# EAGLE schematic brain_v01 (EAGLE 9.5.2)
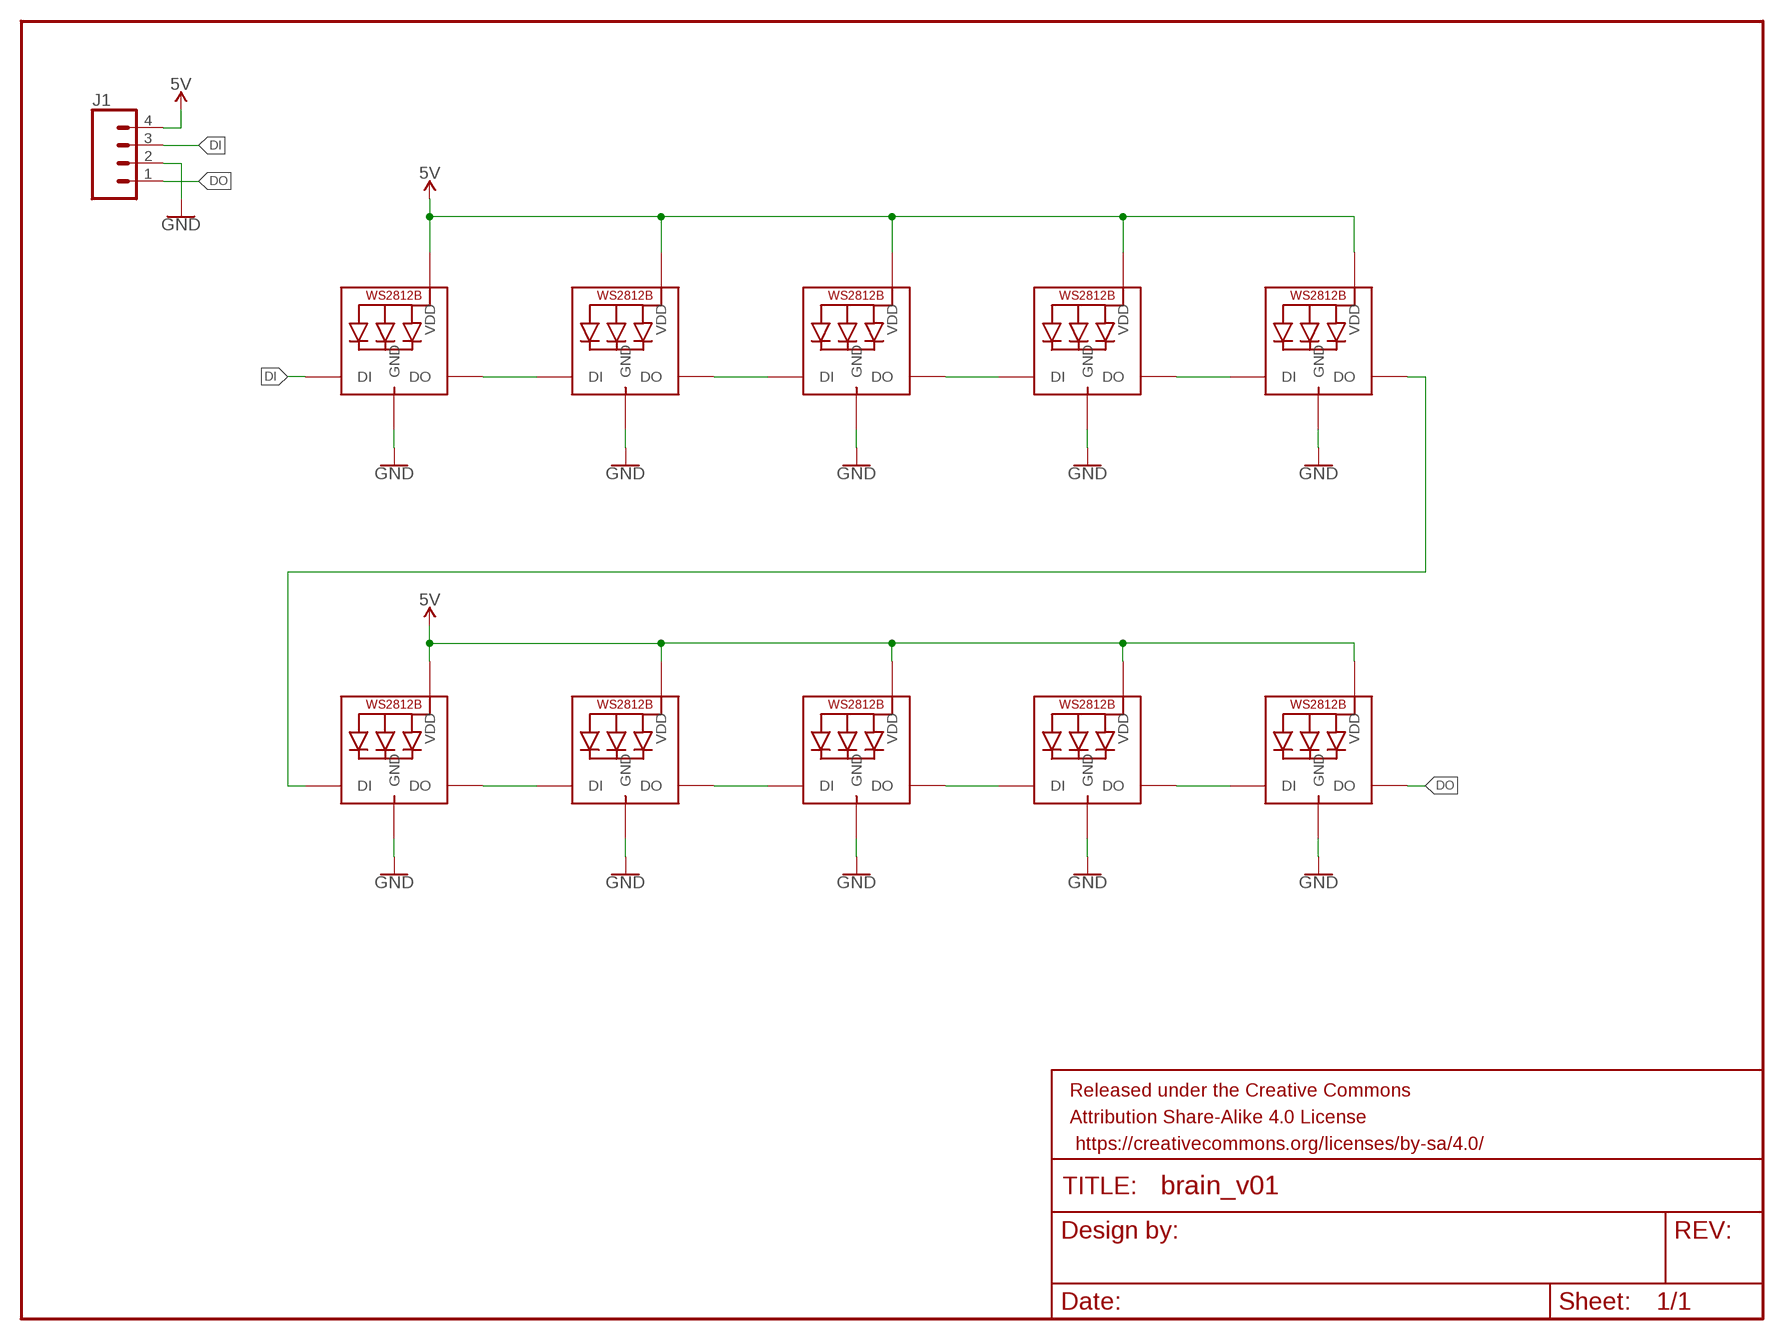
[diagram p0: schematic, sheet 1]

## Parts
FRAME1  FRAME-LETTER  [CREATIVE_COMMONS]
J1  CONN_04PTH  [1X04]
LED1  WS2812B3535  [LED3535]
LED2  WS2812B3535  [LED3535]
LED3  WS2812B3535  [LED3535]
LED4  WS2812B3535  [LED3535]
LED5  WS2812B3535  [LED3535]
LED6  WS2812B3535  [LED3535]
LED7  WS2812B3535  [LED3535]
LED8  WS2812B3535  [LED3535]
LED9  WS2812B3535  [LED3535]
LED10  WS2812B3535  [LED3535]

## Nets
5V: J1.4 LED1.2(VDD) LED2.2(VDD) LED3.2(VDD) LED4.2(VDD) LED5.2(VDD) LED6.2(VDD) LED7.2(VDD) LED8.2(VDD) LED9.2(VDD) LED10.2(VDD)
DI: J1.3 LED1.1(DI)
DO: J1.1 LED10.3(DO)
GND: J1.2 LED1.4(GND) LED2.4(GND) LED3.4(GND) LED4.4(GND) LED5.4(GND) LED6.4(GND) LED7.4(GND) LED8.4(GND) LED9.4(GND) LED10.4(GND)
N$1: LED1.3(DO) LED2.1(DI)
N$2: LED2.3(DO) LED3.1(DI)
N$3: LED3.3(DO) LED4.1(DI)
N$4: LED4.3(DO) LED5.1(DI)
N$5: LED6.3(DO) LED7.1(DI)
N$6: LED7.3(DO) LED8.1(DI)
N$7: LED8.3(DO) LED9.1(DI)
N$8: LED9.3(DO) LED10.1(DI)
N$9: LED5.3(DO) LED6.1(DI)

## Library data of the parts
FRAME1 = SparkFun-Aesthetics:FRAME-LETTER: Schematic Frame - Letter Standard 8.5x11 US Letter frame
J1 = SparkFun-Connectors:CONN_04: Multi connection point. Often used as Generic Header-pin footprint for 0.1 inch spaced/style header connections On any of the 0.1 inch spaced packages, you can populate with these: Break Away Headers - Straight <https://www.sparkfun.com/products/116> (PRT-00116) Break Away Male Headers - Right Angle <https://www.sparkfun.com/products/553> (PRT-00553) Female Headers <https://www.sparkfun.com/products/115> (PRT-00115) Break Away Headers - Machine Pin <https://www.sparkfun.com/products/117> (PRT-00117) Break Away Female Headers - Swiss Machine Pin <https://www.sparkfun.com/products/743> (PRT-00743) For SCREWTERMINALS and SPRING TERMINALS visit here: Screw Terimnals on SparkFun.com <https://www.sparkfun.com/search/results?term=Screw+Terminals> (5mm/3.5mm/2.54mm spacing) This device is also useful as a general connection point to wire up your design to another part of your project. Our various solder wires solder well into these plated through hole pads. Hook-Up Wire - Assortment (Stranded, 22 AWG) <https://www.sparkfun.com/products/11375> (PRT-11375) Hook-Up Wire - Assortment (Solid Core, 22 AWG) <https://www.sparkfun.com/products/11367> (PRT-11367) View the entire wire category on our website here <https://www.sparkfun.com/categories/141> Special notes: Molex polarized connector foot print use with SKU : PRT-08231 with associated crimp pins and housings. 1MM SMD Version SKU: PRT-10208; PROD_ID: CONN-09696
LED1-LED10 = adafruit:WS2812B